# EAGLE design Adafruit HUSB238 USB-C PD Breakout (EAGLE 9.6.2)
COMPANY: ADAFRUIT INDUSTRIES; DRAWN: KTOWN; REV: A; YEAR: 2019
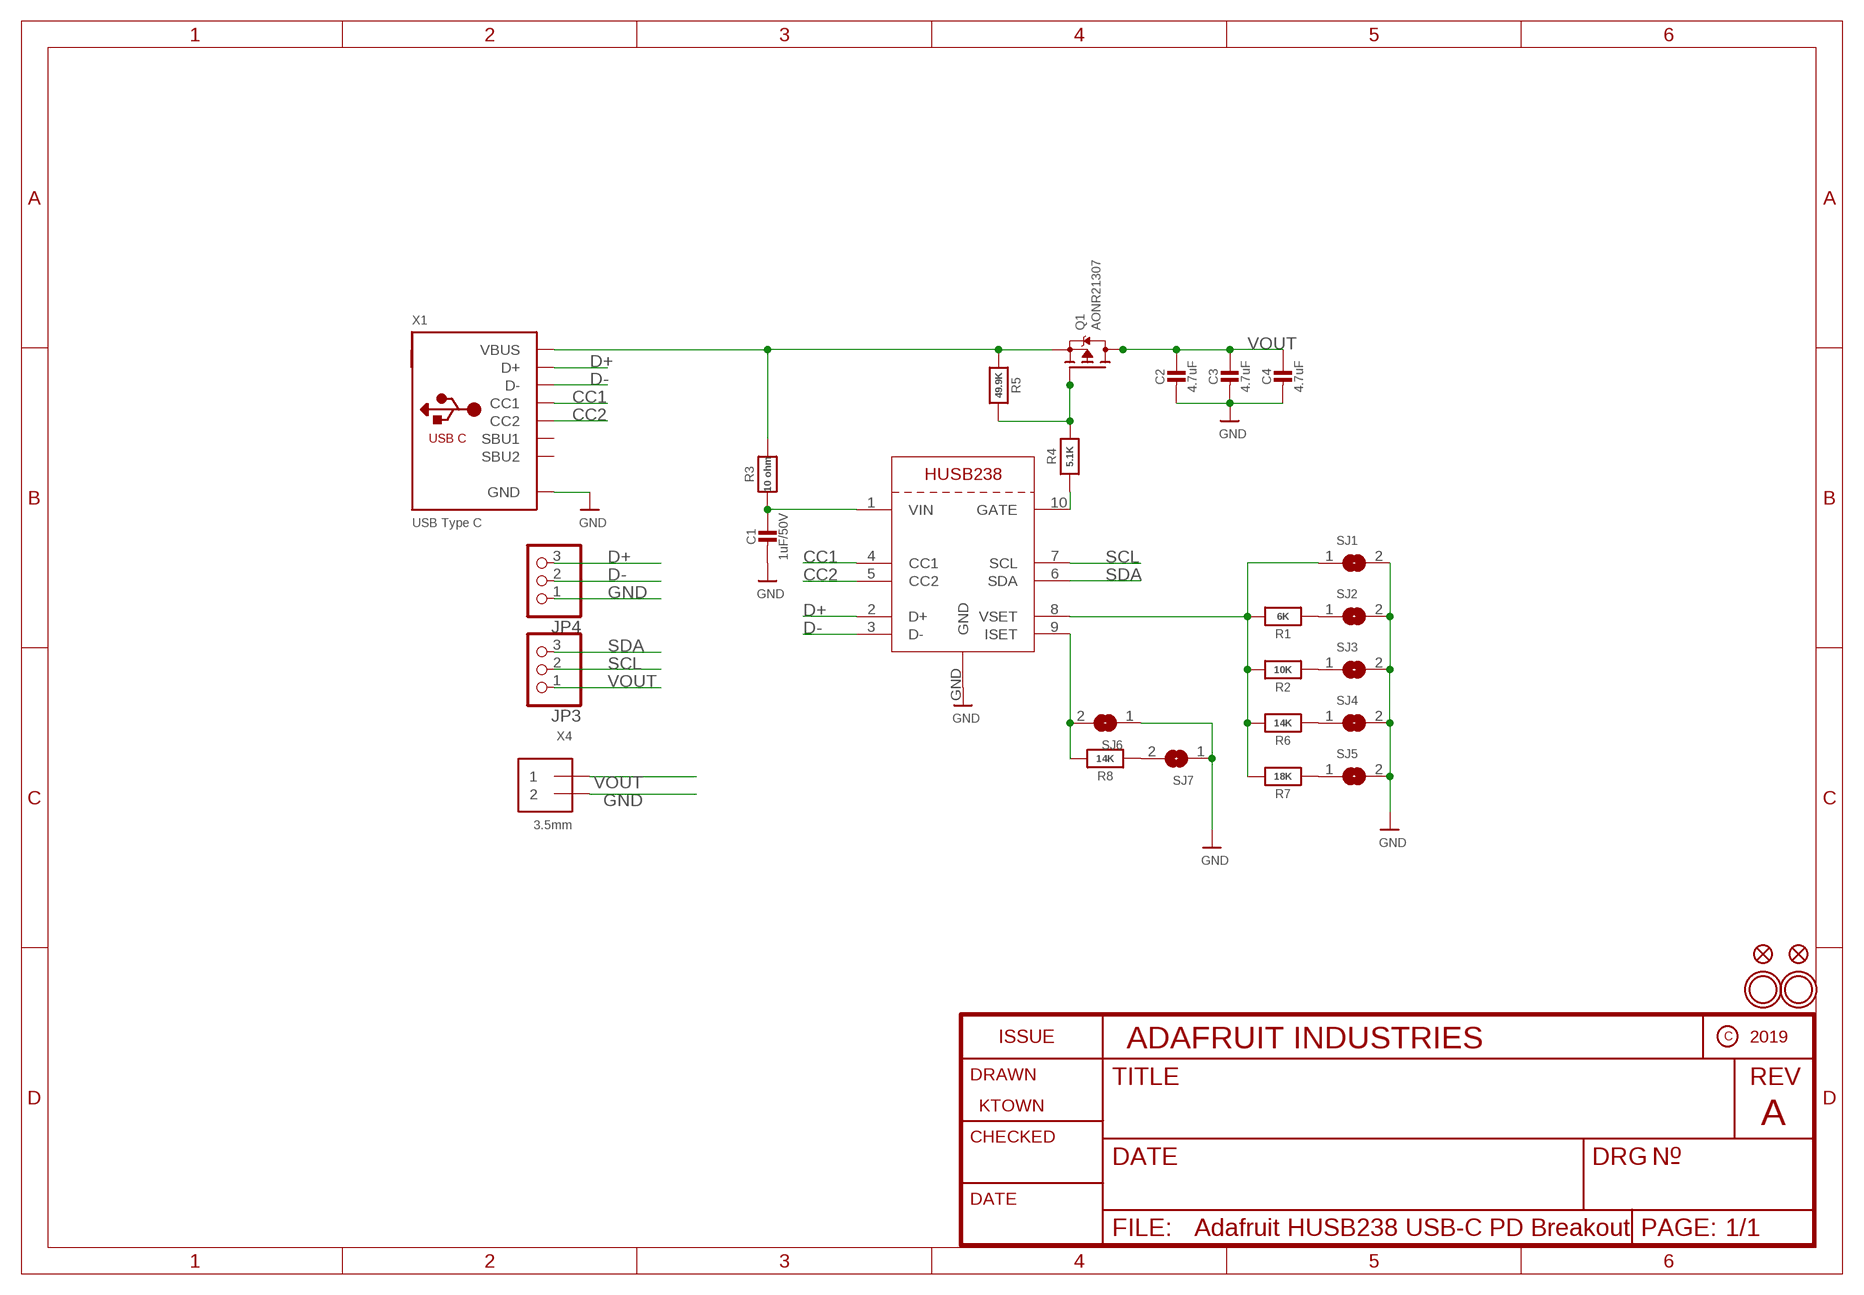
[diagram p0: schematic, sheet 1]

## Parts
C1  1uF/50V  CAP_CERAMIC0805-NOOUTLINE  [0805-NO]
C2  4.7uF  CAP_CERAMIC0805-NOOUTLINE  [0805-NO]
C3  4.7uF  CAP_CERAMIC0805-NOOUTLINE  [0805-NO]
C4  4.7uF  CAP_CERAMIC0805-NOOUTLINE  [0805-NO]
FID1  FIDUCIAL_1MM  [FIDUCIAL_1MM]
FID2  FIDUCIAL_1MM  [FIDUCIAL_1MM]
JP3  HEADER-1X3ROUND  [1X03_ROUND]
JP4  HEADER-1X3ROUND  [1X03_ROUND]
Q1  AONR21307  MOSFET-P-POWERDI3333  [POWERDI3333]
R1  6K  RESISTOR_0603_NOOUT  [0603-NO]
R2  10K  RESISTOR_0603_NOOUT  [0603-NO]
R3  10 ohm  RESISTOR_0603_NOOUT  [0603-NO]
R4  5.1K  RESISTOR_0603_NOOUT  [0603-NO]
R5  49.9K  RESISTOR_0603_NOOUT  [0603-NO]
R6  14K  RESISTOR_0603_NOOUT  [0603-NO]
R7  18K  RESISTOR_0603_NOOUT  [0603-NO]
R8  14K  RESISTOR_0603_NOOUT  [0603-NO]
SJ1  SOLDERJUMPERCLOSED  [SOLDERJUMPER_CLOSEDWIRE]
SJ2  SOLDERJUMPER  [SOLDERJUMPER_ARROW_NOPASTE]
SJ3  SOLDERJUMPER  [SOLDERJUMPER_ARROW_NOPASTE]
SJ4  SOLDERJUMPER  [SOLDERJUMPER_ARROW_NOPASTE]
SJ5  SOLDERJUMPER  [SOLDERJUMPER_ARROW_NOPASTE]
SJ6  SOLDERJUMPERCLOSED  [SOLDERJUMPER_CLOSEDWIRE]
SJ7  SOLDERJUMPER  [SOLDERJUMPER_ARROW_NOPASTE]
U$1  MOUNTINGHOLE2.5  [MOUNTINGHOLE_2.5_PLATED]
U$2  MOUNTINGHOLE2.5  [MOUNTINGHOLE_2.5_PLATED]
X1  USB Type C  USB_C  [USB_C_CUSB31-CFM2AX-01-X]
X3  HUSB238  [DFN10_3X3MM]
X4  3.5mm  TERMBLOCK_1X2_3.5MM  [TERMBLOCK_1X2-3.5MM]

## Nets
CC1: X1.A5(CC1) X3.4(CC1)
CC2: X1.B5(CC2) X3.5(CC2)
D+: JP4.3 X1.A6(D+) X1.B6(D+) X3.2(D+)
D-: JP4.2 X1.A7(D-) X1.B7(D-) X3.3(D-)
GND: C1.2 C2.2 C3.2 C4.2 JP4.1 SJ1.2 SJ2.2 SJ3.2 SJ4.2 SJ5.2 SJ6.1 SJ7.1 X1.A1B12(GND) X1.B1A12(GND) X3.GND X4.2
N$1: C1.1 R3.1 X3.1(VIN)
N$2: Q1.4(G) R4.2 R5.2
N$3: R1.2 R2.2 R6.2 R7.2 SJ1.1 X3.8(VSET)
N$4: R4.1 X3.10(GATE)
N$5: R1.1 SJ2.1
N$6: R2.1 SJ3.1
N$7: R6.1 SJ4.1
N$8: R7.1 SJ5.1
N$9: R8.2 SJ6.2 X3.9(ISET)
N$10: R8.1 SJ7.2
SCL: JP3.2 X3.7(SCL)
SDA: JP3.3 X3.6(SDA)
VBUS: Q1.1(S) Q1.2(S) Q1.3(S) R3.2 R5.1 X1.A4B9(VBUS) X1.B4A9(VBUS)
VOUT: C2.1 C3.1 C4.1 JP3.1 Q1.5678(D) X4.1
Unconnected: X1.A8(SBU1) X1.B8(SBU2)

## Library data of the parts
C1-C4 = microbuilder:CAP_CERAMIC: Ceramic Capacitors For new designs, use the packages preceded by an '_' character since they are more reliable: The following footprints should be used on most boards: _0402 - Standard footprint for regular board layouts _0603 - Standard footprint for regular board layouts _0805 - Standard footprint for regular board layouts _1206 - Standard footprint for regular board layouts For extremely tight-pitch boards where space is at a premium, the following 'micro-pitch' footprints can be used (smaller pads, no silkscreen outline, etc.): _0402MP - Micro-pitch footprint for very dense/compact boards _0603MP - Micro-pitch footprint for very dense/compact boards _0805MP - Micro-pitch footprint for very dense/compact boards _1206MP - Micro-pitch footprint for very dense/compact boards
FID1 FID2 = microbuilder:FIDUCIAL: Fiducial Alignment Points Various fiducial points for machine vision alignment.; BOM: EXCLUDE
JP3 JP4 = microbuilder:HEADER-1X3: PIN HEADER
Q1 = microbuilder:MOSFET-P: P-Channel Mosfet LEGEND VDS: Voltage Drain-Source ID: Drain Current RDS(ON): Drain-Source On-State Resistance VGS(TH): Gate-Source Threshold Voltage CISS: Drain-Source Input Capacitance SOT-23 Name VDS ID RDS(ON) VGS(TH) CISS Order Number IRLML5103 30V 760mA 600 mOhm -- 75pF @ 25V Digikey: IRLML5103PBFCT-ND IRLML6401 12V 4.3A 50 mOhm 950mV @ 250µA 830pF @ 10V Digikey: IRLML6401PBFTR-ND NTR0202PL 20V 400mA 800 mOhm 2.3V @ 250uA 70pF @ 5V Digikey: NTR0202PLT1GOSTR-ND NTR4101PT1G 20V 1.8A 85 mOhm 1.2V @ 250uA 675pF @ 10V Digikey: NTR4101PT1GOSCT-ND DMP2004K 20V 600mA 900 mOhm 1V @ 250uA 175pF @ 16V Digikey: DMP2004KDICT-ND PMV65XP 20V 3.9A 76 mOhm 950mV @ 1mA 725pF @ 20V Digikey: 568-2358-2-ND TO-252 Name VDS ID RDS(ON) VGS(TH) CISS Order Number AOD417 30V 25A 34 mOhm 3V @ 250µA 920pF @ 15V Digikey: 785-1106-2-ND PowerPak Name VDS ID RDS(ON) VGS(TH) CISS Order Number AON7401 30V 12A 14 mOhm 3V @ 250µA 2600pF @ 15V Digikey: 785-1302-1-ND; ROT: 270
R1-R8 = microbuilder:RESISTOR: Resistors For new designs, use the packages preceded by an '_' character since they are more reliable: The following footprints should be used on most boards: _0402 - Standard footprint for regular board layouts _0603 - Standard footprint for regular board layouts _0805 - Standard footprint for regular board layouts _1206 - Standard footprint for regular board layouts For extremely tight-pitch boards where space is at a premium, the following 'micro-pitch' footprints can be used (smaller pads, no silkscreen outline, etc.): _0402MP - Micro-pitch footprint for very dense/compact boards _0603MP - Micro-pitch footprint for very dense/compact boards _0805MP - Micro-pitch footprint for very dense/compact boards _1206MP - Micro-pitch footprint for very dense/compact boards
SJ1 SJ6 = microbuilder:SOLDERJUMPER: SMD Solder JUMPER Solder the two pads together to create a connection, or remove the solder to break it. REFLOW - Use this footprint for solder paste and reflow ovens. WAVE - Use this footprint for hand-soldering (larger pads). CLOSED - Has a trace between the two pads to ensure it is closed by default. The trace needs to be cut to disable the jumper, and can be closed again by creating a solder bridge between the two pads.
SJ2-SJ5 SJ7 = microbuilder:SOLDERJUMPER: SMD Solder JUMPER Solder the two pads together to create a connection, or remove the solder to break it. REFLOW - Use this footprint for solder paste and reflow ovens. WAVE - Use this footprint for hand-soldering (larger pads). CLOSED - Has a trace between the two pads to ensure it is closed by default. The trace needs to be cut to disable the jumper, and can be closed again by creating a solder bridge between the two pads.; BOM: EXCLUDE
U$1 U$2 = adafruit_electromech:MOUNTINGHOLE: Mounting Hole For #2 screws (0.086"/2.18mm width, 0.094"/2.4mm hole) use 2.5mm; BOM: EXCLUDE
X1 = adafruit_electromech:USB_C: USB Type-C USB 2.0 Connector; LCSC: C165948
X3 = adafruit_power:HUSB238
X4 = adafruit_electromech:TERMBLOCK_1X2: 3.5mm Terminal block http://www.ladyada.net/library/pcb/eaglelibrary.html; ROT: 180

## Board
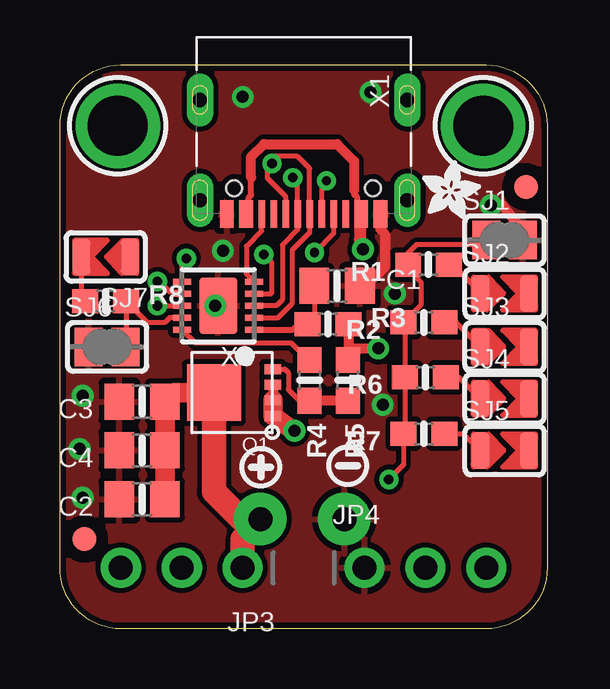
[diagram p1: board, top side]
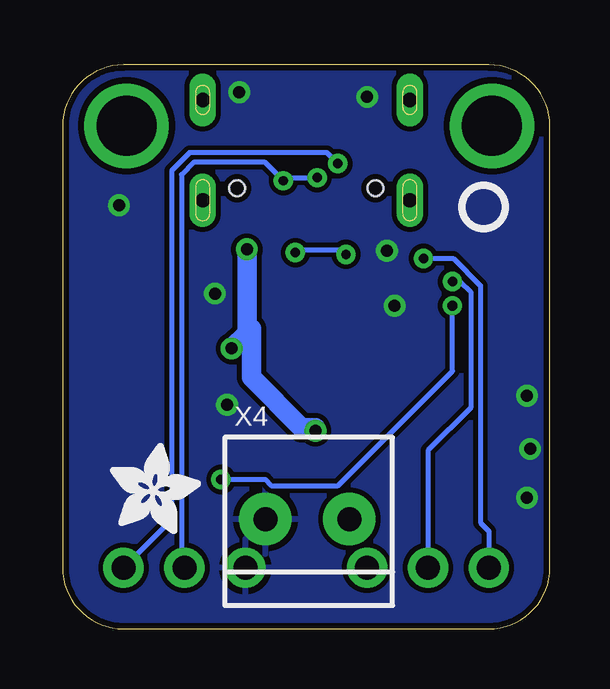
[diagram p2: board, bottom side, seen from below]

Size 20.32 x 23.5 mm. Coordinates in mm from the lower left corner, seen from the top.
Outline: 20.32,20.95 20.32,2.54 arc-90 17.78,0 2.54,0 arc-90 0,2.54 0,20.95 arc-90 2.54,23.5 17.78,23.5 arc-90 20.32,20.95
Copper layers (1*16): Top 0.035mm / dielectric 1.5mm / Bottom 0.035mm
Design rules "adafruit": minimum track width 8mil, minimum drill 15.5mil, track to track 8mil, track to pad 8mil, pad to pad 8mil, via to via 8mil, smd to smd 8mil, copper to edge 10mil, drill to drill 8mil, minimum pad ring 10mil, minimum via ring 8mil, stop-mask expansion 2mil, vias tented up to drill 20mil, thermal gap 10mil

### Footprints (pad centres in the part's own frame; a part is rotated, then mirrored left to right if it is on the bottom)
0805-NO = smd 1.24 x 1.5: 1 -0.95,0; 2 0.95,0
FIDUCIAL_1MM = smd 1 x 1: 1 0,0
1X03_ROUND = drill 1 pad 1.676: 1 -2.54,0; 2 0,0; 3 2.54,0
POWERDI3333 = smd 0.7 x 0.42: 1 -1.446,0.975; 2 -1.446,0.325; 3 -1.446,-0.325; 4 -1.446,-0.975 | smd 2.25 x 2.35: 5678 1.004,0
0603-NO = smd 1.075 x 1: 1 -0.85,0; 2 0.85,0
SOLDERJUMPER_CLOSEDWIRE = smd 1.168 x 1.6: 1 -0.762,0; 2 0.762,0 | smd 0.635 x 0.203: WIRE 0,0
SOLDERJUMPER_ARROW_NOPASTE = smd 0.762 x 1.524: 1 -1.016,0; 2 1.016,0
MOUNTINGHOLE_2.5_PLATED = drill 2.5 pad 3.2: P$1 0,0
USB_C_CUSB31-CFM2AX-01-X = smd 0.575 x 1.15: A1B12 -3.2,2.275; A4B9 -2.4,2.275; B1A12 3.2,2.275; B4A9 2.4,2.275 | smd 0.275 x 1.15: A5 -1.25,2.275; A6 -0.25,2.275; A7 0.25,2.275; A8 1.25,2.275; B5 1.75,2.275; B6 0.75,2.275; B7 -0.75,2.275; B8 -1.75,2.275 | drill 0.6 pad 1 long: M1 -4.32,1.7; M2 4.32,1.7; M3 -4.32,-2.48; M4 4.32,-2.48 | hole 0.65: 2.89,1.2; -2.89,1.2
DFN10_3X3MM = smd 0.25 x 0.8: 1 -1,-1.5; 2 -0.5,-1.5; 3 0,-1.5; 4 0.5,-1.5; 5 1,-1.5; 6 1,1.5; 7 0.5,1.5; 8 0,1.5; 9 -0.5,1.5; 10 -1,1.5 | smd 2.35 x 1.58: GND 0,0
TERMBLOCK_1X2-3.5MM = drill 1 pad 2.184: 1 1.8,0; 2 -1.7,0

### Placement (x,y rotation side)
C1  11.56,14.29 0 top
C2  3.43,5.4 180 top
C3  3.43,9.46 180 top
C4  3.43,7.43 180 top
FID1  1.02,3.75 180 top
FID2  19.43,18.41 180 top
JP3  5.08,2.54 180 top
JP4  15.24,2.54 0 top
PLABEL0  [PLABEL0]  5.27,1.4 0 top
PLABEL1  [PLABEL1]  17.78,1.02 0 top
PLABEL2  [PLABEL2]  15.24,1.02 0 top
PLABEL3  [PLABEL3]  2.6,1.4 0 top
PLABEL4  [PLABEL4]  9.84,15.88 0 top
PLABEL5  [PLABEL5]  15.81,16.38 0 top
PLABEL6  [PLABEL6]  15.75,13.97 0 top
PLABEL7  [PLABEL7]  15.3,11.62 0 top
PLABEL8  [PLABEL8]  15.3,9.33 0 top
PLABEL9  [PLABEL9]  15.3,6.99 0 top
PLABEL10  [PLABEL10]  15.3,5.46 0 top
PLABEL11  [PLABEL11]  18.61,5.46 0 top
PLABEL12  [PLABEL12]  4.32,11.43 90 top
PLABEL13  [PLABEL13]  4.25,15.75 90 top
PLABEL14  [PLABEL14]  4.25,17.97 90 top
PLABEL15  [PLABEL15]  1.97,18.1 0 top
PLABEL16  [PLABEL16]  7.68,1.4 0 top
PLABEL17  [PLABEL17]  12.7,1.4 0 top
PLABEL18  [PLABEL18]  10.16,19.94 0 bottom
PLABEL19  [PLABEL19]  10.16,12.13 0 bottom
Q1  7.43,9.84 180 top
R1  15.37,15.18 180 top
R2  15.18,12.76 180 top
R3  11.18,12.7 0 top
R4  10.41,10.35 270 top
R5  12,10.35 270 top
R6  15.24,10.48 180 top
R7  15.18,8.13 180 top
R8  1.91,13.65 0 top
SJ1  18.54,16.19 0 top
SJ2  18.54,13.97 0 top
SJ3  18.54,11.75 0 top
SJ4  18.54,9.59 0 top
SJ5  18.54,7.43 0 top
SJ6  1.97,11.75 0 top
SJ7  1.91,15.49 180 top
U$1  17.65,20.95 180 top
U$2  2.41,20.95 180 top
U$3  [ADAFRUIT_2.5MM]  15.11,17.08 0 top
U$7  [SYMBOL_PLUS]  8.38,6.73 0 top
U$8  [PCBFEAT-REV-040]  2.77,17.58 180 bottom
U$9  [ADAFRUIT_3.5MM]  18.35,3.94 0 bottom
U$14  [SYMBOL_MINUS]  12,6.79 0 top
X1  10.16,19.56 180 top
X3  6.6,13.46 90 top
X4  10.16,4.57 0 bottom

### Tracks (layer width: path | path; a pad name or v marks a point on that pad's centre or on a via)
CC1  (via drill 0.39)
  Top 0.203: v8.5,15.6 8.82,15.28 8.82,13.96 X3.4 | X1.A5 11.41,16.47 v10.61,15.68
  Bottom 0.203: v10.61,15.68 10.61,15.8 8.71,15.8 v8.5,15.6
CC2
  Top 0.203: X3.5 7.78,14.79 7.78,15.95 8.41,16.58 X1.B5
D+  (via drill 0.4)
  Top 0.203: X3.2 9.1,12.96 9.68,13.55 9.68,15.78 10.41,16.51 X1.A6 10.41,19.18 9.91,19.68 8.89,19.68 8.76,19.56 | 8.76,19.56 8.64,19.43 8.64,18.8 9.41,18.02 X1.B6 | 8.76,19.56 8.84,19.48 v8.84,19.38
  Bottom 0.203: v8.84,19.38 9.3,19.84 15.03,19.84 15.77,19.09 15.77,4.55 JP4.3
D-  (via drill 0.39)
  Top 0.203: v9.71,18.8 9.91,18.59 X1.A7 9.91,16.64 9.27,16 9.27,13.71 9.02,13.46 X3.3 | v11.12,18.67 11,18.55 10.91,18.55 X1.B7
  Bottom 0.203: v9.71,18.8 10.99,18.8 v11.12,18.67 11.88,19.43 14.86,19.43 15.37,18.92 15.37,2.67 JP4.2
GND  (via drill 0.5)
  Top 0.406: X1.A1B12 13.36,16.65 13.55,16.46 13.55,15.07 12.76,14.29 C1.2 | SJ1.2 19.3,16.63 18.46,17.65 v17.97,17.65
  other vias: 13.97,13.97 6.48,13.46 13.46,9.33 0.95,9.72 0.83,7.49 0.95,5.46 6.79,15.75 7.62,22.16 12.95,22.35
  pour Top: 0,23.5 20.32,23.5 20.32,0 0,0
  pour Bottom: 0,23.5 20.32,23.5 20.32,0 0,0
N$1
  Top 0.203: C1.1 10.61,12.98 R3.1
  Top 0.254: R3.1 9.95,12.7 9.71,12.46 X3.1
N$2
  Top 0.203: Q1.4 9.38,10.82 9.53,10.66 9.53,9.97 9.97,9.53 10.41,9.53
  Top 0.406: 10.41,9.53 R4.2 R5.2
N$3  (via drill 0.4)
  Top 0.203: SJ1.1 17.34,16 14.87,16 14.37,15.5 14.37,15.32 | v13.72,6.22 14.33,6.83 R7.2 14.39,8.19 R6.2 14.39,12.7 R2.2 15.05,13.49 15.05,14.45 14.37,15.13 14.37,15.32 | v4.06,13.46 X3.8 | R1.2 14.37,15.32
  Bottom 0.203: v13.72,6.22 11.87,6.22 11.62,5.97 8.83,5.97 4.06,10.73 v4.06,13.46
N$4
  Top 0.203: X3.10 5.67,11.9 9.65,11.9 10.35,11.2 R4.1
N$5
  Top 0.203: R1.1 16.38,15.18 17.91,13.65 17.84,13.65 SJ2.1
N$6
  Top 0.203: R2.1 16.51,12.76 SJ3.1
N$7
  Top 0.203: R6.1 16.64,10.48 SJ4.1
N$8
  Top 0.203: R7.1 16.83,8.13 SJ5.1
N$9
  Top 0.203: SJ6.2 2.75,11.98 R8.2 3.65,12.75 4.36,12.75 4.57,12.96 X3.9
N$10
  Top 0.203: SJ7.2 0.89,13.82 R8.1
SCL  (via drill 0.39)
  Top 0.203: X3.7 5.03,14.03 4.59,14.03 4.16,14.47 v4.06,14.47
  Bottom 0.203: v4.06,14.47 3.74,14.47 3.3,14.03 3.3,9.21 5.08,7.43 JP3.2
SDA  (via drill 0.39)
  Top 0.203: X3.6 5.1,15.26 v5.27,15.43
  Bottom 0.203: v5.27,15.43 4.03,15.43 2.9,14.3 2.9,4.42 2.54,4.06 JP3.3
VBUS  (via drill 0.5)
  Top 0.254: X1.B4A9 7.86,17.19 7.87,17.02 7.87,17.96 7.98,18.07 7.98,18.8 | 12.27,18.29 12.27,18.11 12.38,18 12.38,16.2 X1.A4B9
  Top 0.406: 7.98,18.8 7.98,19.66 8.51,20.19 11.56,20.19 12.27,19.48 12.27,18.29 | R3.2 12.03,11.68 12.48,11.68 | Q1.3 Q1.2 | X1.A4B9 12.56,15.89 v12.64,15.81 | 12.48,11.68 v13.27,11.68 | R5.1 12.48,11.68 | 9.74,8.26 v9.78,8.26
  Top 0.813: Q1.2 Q1.1 9.74,8.26
  Bottom 0.406: 12.45,12.51 12.64,12.32 | v9.78,8.26 9.78,8.38
  Bottom 0.813: v12.64,15.81 12.64,12.32 v13.27,11.68 | 9.78,8.38 10.35,8.38 12.45,10.48 12.45,12.51
VOUT
  Top 0.406: C3.1 4.76,9.84
  Top 0.813: 4.76,9.84 Q1.5678 | C3.1 C4.1 C2.1
  Top 1.016: Q1.5678 6.43,5.71 7.63,4.51 X4.1 8.4,4.51 7.62,3.73 JP3.1

### Text on the board
Pinguin_tBackup: open | 3A | 2A | HUSB238 | 5V | 9V | 12V | 1A | 15V | 18V | 20V | open | SDA | SCL | V+ | GND | D- | D+
Pinguin_bBackup: HUSB238 | USB Type C PD Sink / 5/9/12/15/18/20V / Select jumpers or use / I2C addr 0x08 to config